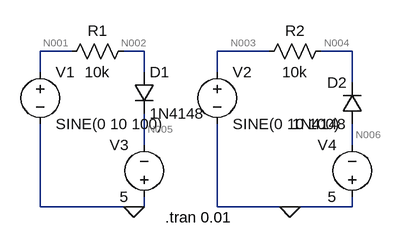
[diagram p0: schematic Draft9.asc]
Draft9.asc, the LTspice schematic file:
Version 4.1
SHEET 1 880 680
WIRE 96 32 48 32
WIRE 208 32 176 32
WIRE 400 32 320 32
WIRE 528 32 480 32
WIRE 48 64 48 32
WIRE 208 64 208 32
WIRE 320 64 320 32
WIRE 528 80 528 32
WIRE 208 176 208 128
WIRE 528 176 528 144
WIRE 48 272 48 144
WIRE 192 272 48 272
WIRE 208 272 208 256
WIRE 208 272 192 272
WIRE 320 272 320 144
WIRE 432 272 320 272
WIRE 528 272 528 256
WIRE 528 272 432 272
FLAG 192 272 0
FLAG 432 272 0
SYMBOL voltage 48 48 R0
WINDOW 123 0 0 Left 0
WINDOW 39 0 0 Left 0
SYMATTR InstName V1
SYMATTR Value SINE(0 10 100)
SYMBOL voltage 320 48 R0
WINDOW 123 0 0 Left 0
WINDOW 39 0 0 Left 0
SYMATTR InstName V2
SYMATTR Value SINE(0 10 100)
SYMBOL res 192 16 R90
WINDOW 0 0 56 VBottom 2
WINDOW 3 32 56 VTop 2
SYMATTR InstName R1
SYMATTR Value 10k
SYMBOL res 496 16 R90
WINDOW 0 0 56 VBottom 2
WINDOW 3 32 56 VTop 2
SYMATTR InstName R2
SYMATTR Value 10k
SYMBOL diode 192 64 R0
SYMATTR InstName D1
SYMATTR Value 1N4148
SYMBOL diode 544 144 R180
WINDOW 0 24 64 Left 2
WINDOW 3 24 0 Left 2
SYMATTR InstName D2
SYMATTR Value 1N4148
SYMBOL voltage 208 272 R180
WINDOW 0 24 96 Left 2
WINDOW 3 24 16 Left 2
WINDOW 123 0 0 Left 0
WINDOW 39 0 0 Left 0
SYMATTR InstName V3
SYMATTR Value 5
SYMBOL voltage 528 272 R180
WINDOW 0 24 96 Left 2
WINDOW 3 24 16 Left 2
WINDOW 123 0 0 Left 0
WINDOW 39 0 0 Left 0
SYMATTR InstName V4
SYMATTR Value 5
TEXT 240 288 Left 2 !.tran 0.01

The netlist it stands for:
* Draft9.asc
V1 N001 0 SINE(0 10 100)
V2 N003 0 SINE(0 10 100)
R1 N002 N001 10k
R2 N004 N003 10k
D1 N002 N005 1N4148
D2 N006 N004 1N4148
V3 0 N005 5
V4 0 N006 5
.model D D
.lib standard.dio
.tran 0.01
.backanno
.end

* Results of the author's LTspice run, read from the files saved beside the schematic
* Operating Point, zero values left out:
*   V(n002) = -4.452 V
*   V(n004) = -25.25 µV
*   V(n005) = -5 V
*   V(n006) = -5 V
*   I(D1) = 445.2 µA
*   I(D2) = -2.525 nA
*   I(R1) = -445.2 µA
*   I(R2) = -2.525 nA
*   I(V1) = -445.2 µA
*   I(V2) = -2.525 nA
*   I(V3) = -445.2 µA
*   I(V4) = -2.525 nA
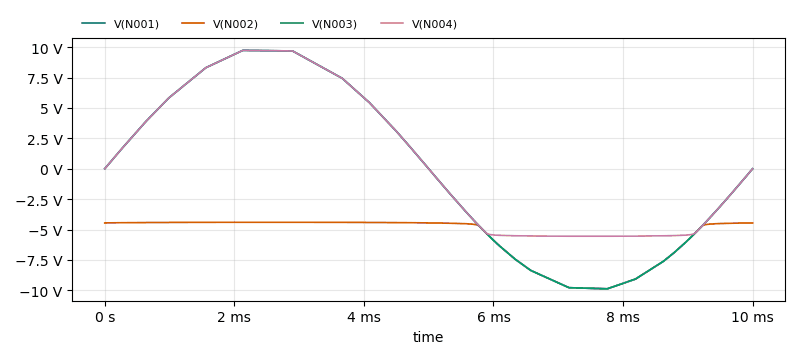
[diagram p1: Transient Analysis of Draft9.asc, plotted from the saved traces]
* Transient Analysis, 1 run:
*   V(N001): min -9.87 V, max 9.734 V, average -22.82 mV, rms 7.02 V, last 0 V
*   V(N002): min -9.87 V, max -4.399 V, average -5.7 V, rms 6.035 V, last -4.452 V
*   V(N003): min -9.87 V, max 9.734 V, average -22.82 mV, rms 7.02 V, last 0 V
*   V(N004): min -5.546 V, max 9.734 V, average 880.9 mV, rms 6.009 V, last -148.4 µV